# Altium schematic sheet ArduinoUnoShield.SchDoc
size A4
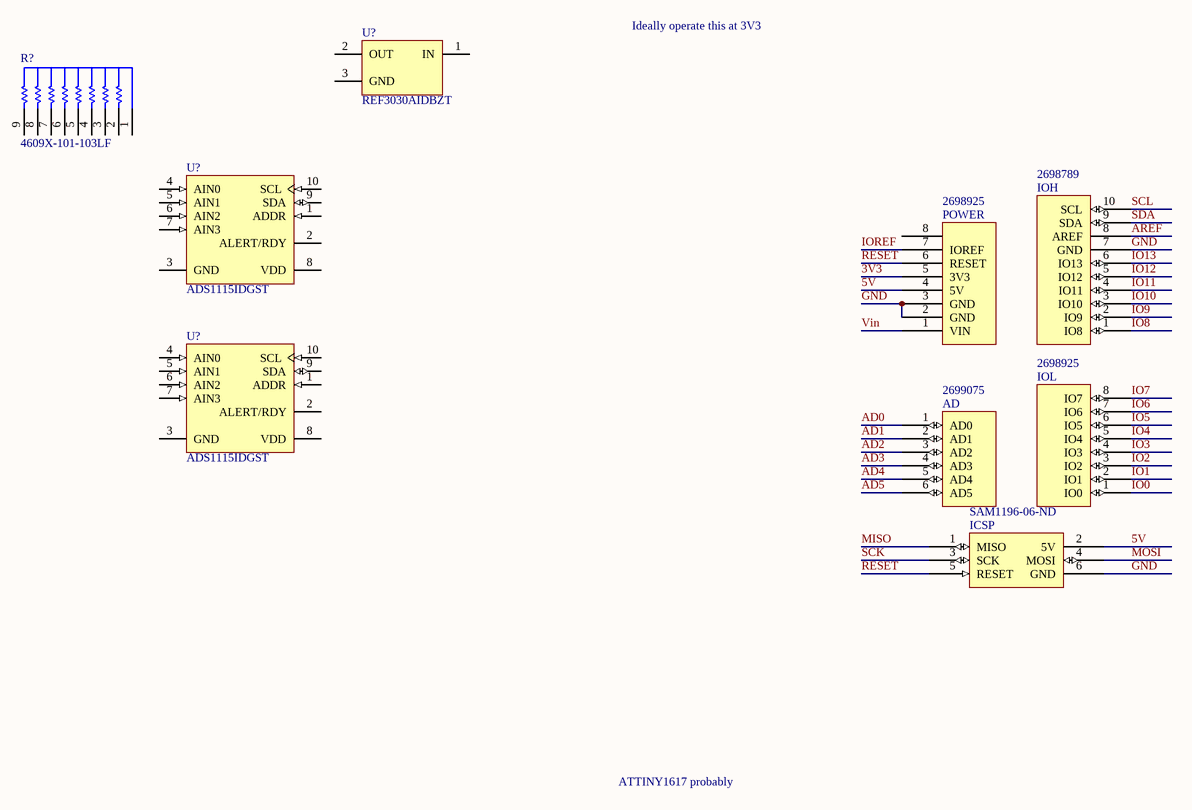
[diagram p0: ArduinoUnoShield.SchDoc]

## Parts
(Parts that share a designator on the sheet are numbered #1, #2 ... from top to bottom, then left to right.)
AD  Supplier Part Number 4: 2699075  [Header 6x1 8.5mm]  (hidden comment: AD)
ICSP  Supplier Part Number 5: SAM1196-06-ND  [ICSP]  (hidden comment: ICSP)
IOH  Supplier Part Number 3: 2698789  [Header 10x1 8.5mm]  (hidden comment: IOH)
IOL  Supplier Part Number 4: 2698925  [Header 8x1 8.5mm]  (hidden comment: IOL)
POWER  Supplier Part Number 4: 2698925  [Header 8x1 8.5mm]  (hidden comment: POWER_UNO)
R?  4609X-101-103LF  [BOUR-4609X]
U?#1  REF3030AIDBZT  [DBZ0003A_N]
U?#2  ADS1115IDGST  [TI-DGS10_M]
U?#3  ADS1115IDGST  [TI-DGS10_M]

## Nets
3V3: POWER.5(3V3)
5V: ICSP.2(5V) POWER.4(5V)
AD0: AD.1(AD0)
AD1: AD.2(AD1)
AD2: AD.3(AD2)
AD3: AD.4(AD3)
AD4: AD.5(AD4)
AD5: AD.6(AD5)
AREF: IOH.8(AREF)
GND: ICSP.6(GND) IOH.7(GND) POWER.2(GND) POWER.3(GND)
IO0: IOL.1(IO0)
IO1: IOL.2(IO1)
IO2: IOL.3(IO2)
IO3: IOL.4(IO3)
IO4: IOL.5(IO4)
IO5: IOL.6(IO5)
IO6: IOL.7(IO6)
IO7: IOL.8(IO7)
IO8: IOH.1(IO8)
IO9: IOH.2(IO9)
IO10: IOH.3(IO10)
IO11: IOH.4(IO11)
IO12: IOH.5(IO12)
IO13: IOH.6(IO13)
IOREF: POWER.7(IOREF)
MISO: ICSP.1(MISO)
MOSI: ICSP.4(MOSI)
RESET: ICSP.5(RESET) POWER.6(RESET)
SCK: ICSP.3(SCK)
SCL: IOH.10(SCL)
SDA: IOH.9(SDA)
Vin: POWER.1(VIN)

Not connected (* = marked no-connect by the designer): POWER 8; R? 1 2 3 4 5 6 7 8 9; U?#1 1(IN) 2(OUT) 3(GND); U?#2 1(ADDR) 2(ALERT/RDY) 3(GND) 4(AIN0) 5(AIN1) 6(AIN2) 7(AIN3) 8(VDD) 9(SDA) 10(SCL); U?#3 1(ADDR) 2(ALERT/RDY) 3(GND) 4(AIN0) 5(AIN1) 6(AIN2) 7(AIN3) 8(VDD) 9(SDA) 10(SCL)

## Notes on the sheet
- Ideally operate this at 3V3
- ATTINY1617 probably

## Library data of the parts
R? = CMP-2000-05605-1: Resistor, Network, 1.13 W, 10 kOhm, -55 to 125 degC, 9-Pin THD, RoHS, Bulk; Manufacturer: Bourns; Tolerance: ±2%; Power, Rating: 1.13W; Resistance: 10kilohms; Temperature, Operating: -55to+125°C; Brand/Series: 4600XSeries; Circuit: BussedArray; Number of Resistors: 8; Package Type: SIP; Dimensions: 0.898x0.098x0.2(22.81x2.49x5.08)LxWxHin.(mm); Package Reference: 4609X; Mounting Technology: ThroughHole; Package Description: 9-Pin Through Hole Device, Body 22.81 x 2.49 mm, Pitch 2.54 mm; Number of Terminals: 9; Datasheet URL: https://datasheet.ciiva.com/11807/0900766b8069ccfd-11807021.pdf; Datasheet Version: 04/2010; Manufacturer URL: http://www.bourns.com/; Mounting Type: ThroughHole
U?#1 = CMP-0367-00152-2: 3.0 V, 50 ppm / degC, 50 uA Series (Bandgap) Voltage Reference, -40 to 125 degC, 3-pin SOT-23 (DBZ), Green (RoHS & no Sb/Br); Manufacturer: Texas Instruments; SubFamily: Series Voltage Reference; Temp Coeff(Typ)(ppm/ degree C): 20; Rating: Catalog; Temp Coeff(Max)(ppm/ degree C): 50; PackageReference: DBZ0003A; Eco-Plan: Green (RoHS & no Sb/Br); ComponentLink1Description: Manufacturer URL; ComponentLink2URL: http://www.ti.com/general/docs/lit/getliterature.tsp?genericPartNumber=REF3030&fileType=pdf; Mounting Technology: Surface Mount; PackageVersion: 4203227/B; ComponentLink1URL: http://www.ti.com/; Code_JEDEC: TO-236; DatasheetVersion: SBVS032F; PackageDescription: 3-Pin Plastic Small Outline, Body 2.92 x 1.3 mm, Pitch 0.95 mm; ComponentLink2Description: Datasheet; ComponentLink3Description: Package Specification; ComponentLink3URL: http://www.ti.com/litv/pdf/mpds108a; PartNumber: REF3030AIDBZT
U?#2 U?#3 = CMP-0003-00378-2: 16-Bit ADC with Integrated Multiplexer, PGA, Comparator, Oscillator, and Reference, -40 to 125 degC, 10-pin SOP (DGS10), Green (RoHS & no Sb/Br); Manufacturer: Texas Instruments; Sample Rate (max)(SPS): 860; SubFamily: Precision ADC (<=10MSPS); Architecture: Delta-Sigma; Digital Supply(Min)(V): 2; Resolution(Bits): 16; Digital Supply(Max)(V): 5.5; INL(Max)(+/-LSB): 1; Interface: Serial I2C; # Input Channels: 4; Eco-Plan: Green (RoHS & no Sb/Br); PackageDescription: 10-Pin Plastic Small Outline, Body 3 x 3 mm, Pitch 0.5 mm; Mounting Technology: Surface Mount; PackageReference: DGS10; DatasheetVersion: SBAS444B; ComponentLink3Description: Package Specification; ComponentLink1Description: Manufacturer URL; PartNumber: ADS1115IDGST; ComponentLink3URL: http://www.ti.com/lit/ml/mpds035b/mpds035b.pdf; ComponentLink2URL: http://www.ti.com/general/docs/lit/getliterature.tsp?genericPartNumber=ADS1115&fileType=pdf; Analog Voltage AV/DD(Min)(V): 2; ComponentLink2Description: Datasheet; PackageVersion: 4073272/C, 02/2004; Analog Voltage AV/DD(Max)(V): 5.5; Code_JEDEC: MO-153; ComponentLink1URL: http://www.ti.com/
AD = AD: Supplier 1: Arrow; Supplier Part Number 1: 2699089; Supplier 2: Digi-Key; Supplier Part Number 2: SAM1198-06-ND; Supplier 3: Arrow; Supplier Part Number 3: 2699088; Supplier 4: Arrow
ICSP = ICSP: Supplier 1: Arrow; Supplier Part Number 1: 2699117; Supplier 2: Arrow; Supplier Part Number 2: 2699116; Supplier 3: Digi-Key; Supplier Part Number 3: SAM1185-06-ND; Supplier 4: Arrow; Supplier Part Number 4: 2699091; Supplier 5: Digi-Key
IOH = IOH: Supplier 1: Arrow; Supplier Part Number 1: 2698803S4475693N1004; Supplier 2: Digi-Key; Supplier Part Number 2: SAM1198-10-ND; Supplier 3: Arrow
IOL = IOL: Supplier 1: Digi-Key; Supplier Part Number 1: SAM1198-08-ND; Supplier 2: Arrow; Supplier Part Number 2: 2698939; Supplier 3: Arrow; Supplier Part Number 3: 2698940; Supplier 4: Arrow
POWER = POWER_UNO: Supplier 1: Digi-Key; Supplier Part Number 1: SAM1198-08-ND; Supplier 2: Arrow; Supplier Part Number 2: 2698939; Supplier 3: Arrow; Supplier Part Number 3: 2698940; Supplier 4: Arrow